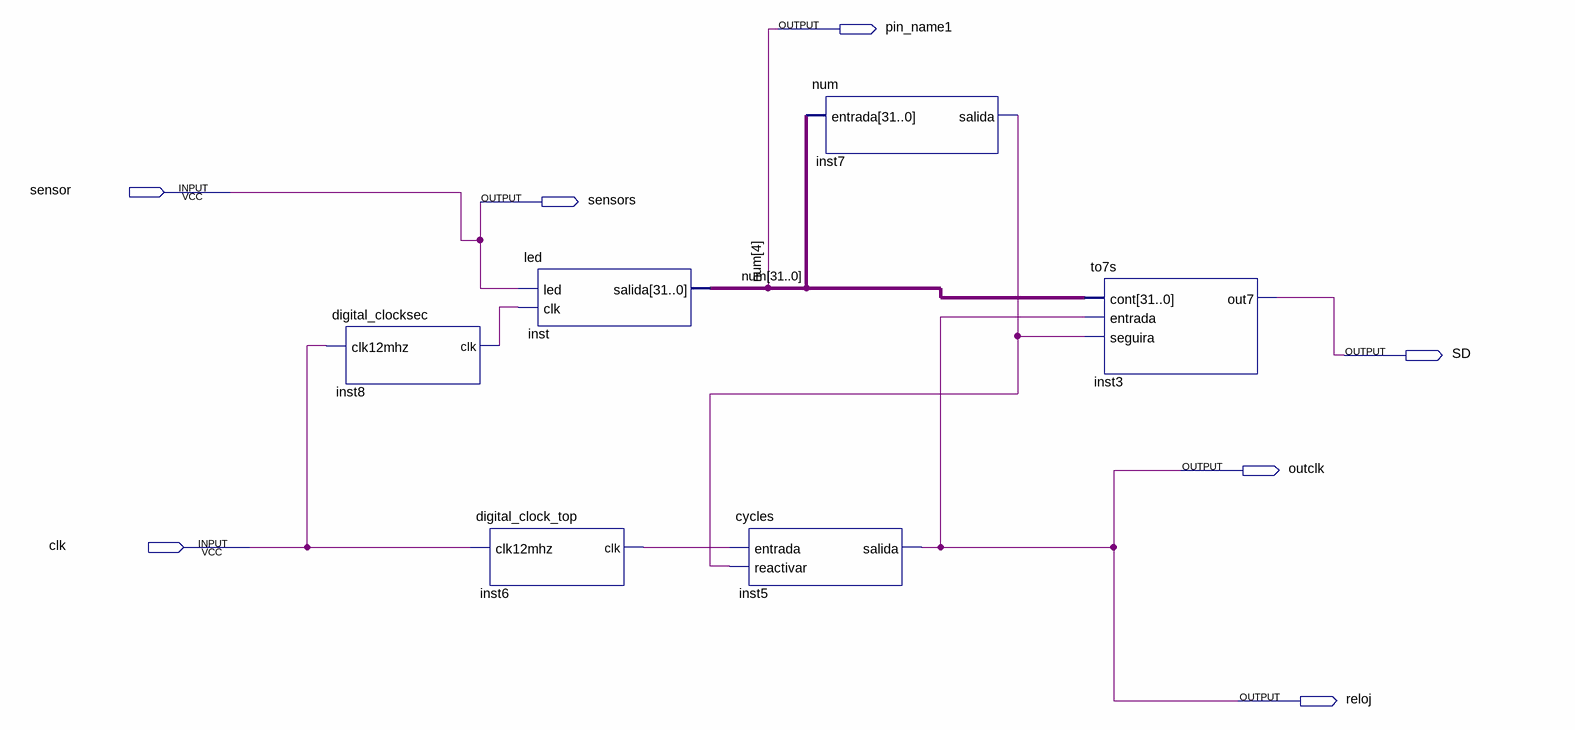
[diagram p0: schematic sheet]
// Quartus schematic final.bdf as structural Verilog: 6 symbols, 7 pins
module \final  (
  input  sensor,
  input  clk,
  output pin_name1,
  output sensors,
  output SD,
  output outclk,
  output reloj
);

  wire inst6_clk, inst7_salida, inst8_clk;
  wire [31:0] num;

  digital_clocksec inst8 (.clk12mhz(clk), .clk(inst8_clk));
  digital_clock_top inst6 (.clk12mhz(clk), .clk(inst6_clk));
  led inst (.led(sensor), .clk(inst8_clk), .salida({num[31:5], pin_name1, num[3:0]}));
  cycles inst5 (.entrada(inst6_clk), .reactivar(inst7_salida), .salida(outclk));
  num inst7 (.entrada({num[31:5], pin_name1, num[3:0]}), .salida(inst7_salida));
  to7s inst3 (.cont({num[31:5], pin_name1, num[3:0]}), .entrada(outclk), .seguira(inst7_salida), .out7(SD));

  assign reloj = outclk;
  assign sensors = sensor;

  // Other names for the same wires on the sheet: num[4] = pin_name1
endmodule
